# Altium schematic sheet supplies.SchDoc
size A
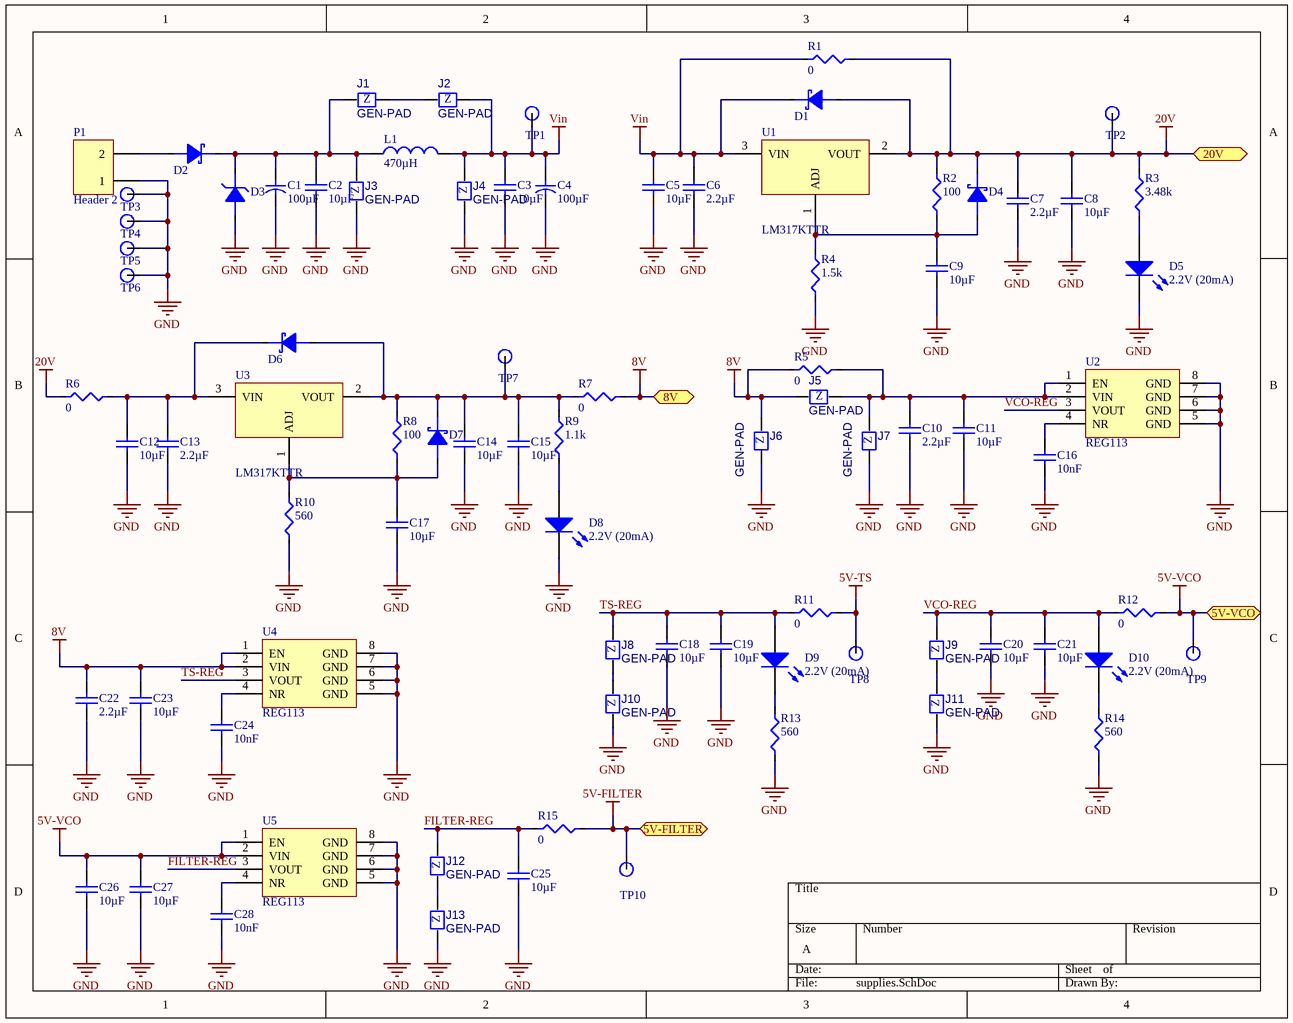
[diagram p0: supplies.SchDoc]

## Parts
C1  100µF  [Radial-SMD-8x10mm]
C2  10µF  [C0805-1.25MM]
C3  10µF  [C0805-1.25MM]
C4  100µF  [Radial-SMD-8x10mm]
C5  10µF  [C0805-1.25MM]
C6  2.2µF  [0402-0.55mm]
C7  2.2µF  [0402-0.55mm]
C8  10µF  [C0805-1.25MM]
C9  10µF  [C0805-1.25MM]
C10  2.2µF  [0402-0.55mm]
C11  10µF  [C0805-1.25MM]
C12  10µF  [C0805-1.25MM]
C13  2.2µF  [0402-0.55mm]
C14  10µF  [0402-0.55mm]
C15  10µF  [0402-0.55mm]
C16  10nF  [C0805-1.25MM]
C17  10µF  [C0805-1.25MM]
C18  10µF  [0402-0.55mm]
C19  10µF  [0402-0.55mm]
C20  10µF  [0402-0.55mm]
C21  10µF  [0402-0.55mm]
C22  2.2µF  [0402-0.55mm]
C23  10µF  [C0805-1.25MM]
C24  10nF  [C0805-1.25MM]
C25  10µF  [0402-0.55mm]
C26  10µF  [0402-0.55mm]
C27  10µF  [0402-0.55mm]
C28  10nF  [C0805-1.25MM]
D1  SCHOTTKY  [SOD-123f]  (value not drawn)
D2  SCHOTTKY  [SOD-123f]  (value not drawn)
D3  ZENER  [DO-214AA]  (value not drawn)
D4  SCHOTTKY  [SOD-123f]  (value not drawn)
D5  2.2V (20mA)  [0805-LED]
D6  SCHOTTKY  [SOD-123f]  (value not drawn)
D7  SCHOTTKY  [SOD-123f]  (value not drawn)
D8  2.2V (20mA)  [0805-LED]
D9  2.2V (20mA)  [0805-LED]
D10  2.2V (20mA)  [0805-LED]
J1  GEN-PAD  [0805-DNP]
J2  GEN-PAD  [0805-DNP]
J3  GEN-PAD  [0805-DNP]
J4  GEN-PAD  [0805-DNP]
J5  GEN-PAD  [0805-DNP]
J6  GEN-PAD  [0805-DNP]
J7  GEN-PAD  [0805-DNP]
J8  GEN-PAD  [0805-DNP]
J9  GEN-PAD  [0805-DNP]
J10  GEN-PAD  [0805-DNP]
J11  GEN-PAD  [0805-DNP]
J12  GEN-PAD  [0805-DNP]
J13  GEN-PAD  [0805-DNP]
L1  value 470µH  [7447709471]  (hidden comment: L)
P1  Header 2  [HDR1X2]
R1  0  [0805-0.45MM]
R2  100  [0805-0.45MM]
R3  3.48k  [0805-0.45MM]
R4  1.5k  [0805-0.45MM]
R5  0  [0805-0.45MM]
R6  0  [0805-0.45MM]
R7  0  [0805-0.45MM]
R8  100  [0805-0.45MM]
R9  1.1k  [0805-0.45MM]
R10  560  [0805-0.45MM]
R11  0  [0805-0.45MM]
R12  0  [0805-0.45MM]
R13  560  [0805-0.45MM]
R14  560  [0805-0.45MM]
R15  0  [0805-0.45MM]
TP1  TP-LOOP  [TP-LOOP]  (value not drawn)
TP2  TP-LOOP  [TP-LOOP]  (value not drawn)
TP3  TP-LOOP  [TP-LOOP]  (value not drawn)
TP4  TP-LOOP  [TP-LOOP]  (value not drawn)
TP5  TP-LOOP  [TP-LOOP]  (value not drawn)
TP6  TP-LOOP  [TP-LOOP]  (value not drawn)
TP7  TP-LOOP  [TP-LOOP]  (value not drawn)
TP8  TP-LOOP  [TP-LOOP]  (value not drawn)
TP9  TP-LOOP  [TP-LOOP]  (value not drawn)
TP10  TP-LOOP  [TP-LOOP]  (value not drawn)
U1  LM317KTTR  [TO-263-4]
U2  REG113  [MSOP8]
U3  LM317KTTR  [TO-263-4]
U4  REG113  [MSOP8]
U5  REG113  [MSOP8]

## Ports
5V-FILTER, 5V-VCO, 8V, 20V

## Nets
5V-FILTER: R15.2 TP10.0 ; port 5V-FILTER
5V-TS: R11.2 TP8.0
5V-VCO: C26.1 C27.1 R12.1 TP9.0 U5.1(EN) U5.2(VIN) ; port 5V-VCO
8V: C22.2 C23.2 J5.2 J6.1 R5.1 R7.2 U4.1(EN) U4.2(VIN) ; port 8V
20V: C7.2 C8.2 D1.A D4.C R1.2 R2.2 R3.2 R6.1 TP2.0 U1.2(VOUT) ; port 20V
GND: C1.1 C2.1 C3.1 C4.1 C5.1 C6.1 C7.1 C8.1 C9.1 C10.1 C11.1 C12.1 C13.1 C14.1 C15.1 C16.1 C17.1 C18.1 C19.1 C20.1 C21.1 C22.1 C23.1 C24.1 C25.2 C26.2 C27.2 C28.1 D3.1(A) D5.C D8.C J3.2 J4.2 J6.2 J7.2 J10.2 J11.2 J13.2 P1.1 R4.1 R10.1 R13.1 R14.1 TP3.0 TP4.0 TP5.0 TP6.0 U2.5(GND) U2.6(GND) U2.7(GND) U2.8(GND) U4.5(GND) U4.6(GND) U4.7(GND) U4.8(GND) U5.5(GND) U5.6(GND) U5.7(GND) U5.8(GND)
Vin: C3.2 C4.2 C5.2 C6.2 D1.C J2.1 J4.1 L1.2 R1.1 TP1.0 U1.3(VIN)
FILTER-REG: C25.1 J12.1 R15.1 U5.3(VOUT)
TS-REG: C18.2 C19.2 D9.A J8.1 R11.1 U4.3(VOUT)
VCO-REG: C20.2 C21.2 D10.A J9.1 R12.2 U2.3(VOUT)
NetC1_2: C1.2 C2.2 D2.C D3.2(C) J1.2 J3.1 L1.1
NetC9_2: C9.2 D4.A R2.1 R4.2 U1.1(ADJ)
NetC10_2: C10.2 C11.2 J5.1 J7.1 R5.2 U2.1(EN) U2.2(VIN)
NetC12_2: C12.2 C13.2 D6.C R6.2 U3.3(VIN)
NetC14_2: C14.2 C15.2 D6.A D7.C R7.1 R8.2 R9.2 TP7.0 U3.2(VOUT)
NetC16_2: C16.2 U2.4(NR)
NetC17_2: C17.2 D7.A R8.1 R10.2 U3.1(ADJ)
NetC24_2: C24.2 U4.4(NR)
NetC28_2: C28.2 U5.4(NR)
NetD2_A: D2.A P1.2
NetD5_A: D5.A R3.1
NetD8_A: D8.A R9.1
NetD9_C: D9.C R13.2
NetD10_C: D10.C R14.2
NetJ1_1: J1.1 J2.2
NetJ8_2: J8.2 J10.1
NetJ9_2: J9.2 J11.1
NetJ12_2: J12.2 J13.1

## Notes on the sheet
- (in symbol EE-GEN-00001) Z

## Library data of the parts
C1 C4 = Radial-SMD-8x10mm: CAP-POL; EE Part Number: EE-CAP-00001; Part Description: CAP ALUM 100UF 50V 20% SMD; Manufacturer: Nichicon; Manufacturer Part Number: UWT1H101MNL1GS; Record Number: 1; Voltage: 50V; Value: 100µF; Datasheet Link: UWT1H101MNL1GS; Supplier 1: DigiKey; Supplier Part Number 1: 493-2226-1-ND; Supplier Link 1: DigiKey; Supplier 2: Mouser; Supplier Part Number 2: 647-UWT1H101MNL1S; Supplier Link 2: Mouser
C2 C3 C5 C8 C9 C12 C17 = C0805-1.25MM: Capacitor; EE Part Number: EE-CAP-00002; Part Description: CAP CER 10UF 35V 10% JB 0805; Manufacturer: TDK; Manufacturer Part Number: C2012JB1V106K085AC; Record Number: 2; Voltage: 35V; PackageDescription: Chip Capacitor; Value: 10µF; Datasheet Link: C2012JB1V106K085AC; Supplier 1: DigiKey; Supplier Part Number 1: 445-11516-1-ND; Supplier Link 1: DigiKey
C6 C7 C13 = 0402-0.55mm: Capacitor; EE Part Number: EE-CAP-00003; Part Description: CAP CER 2.2UF 35V 10% X5R 0402; Manufacturer: TDK; Manufacturer Part Number: C1005X5R1V225K050BC; Record Number: 3; Voltage: 35V; PackageDescription: Chip Capacitor; Value: 2.2µF; Datasheet Link: C1005X5R1V225K050BC; Supplier 1: DigiKey; Supplier Part Number 1: 445-9028-1-ND; Supplier Link 1: DigiKey; Supplier 2: Mouser; Supplier Part Number 2: 810-C1005X5R1V225K; Supplier Link 2: Mouser
C10 C22 = EE-CAP-00003: Capacitor; Part Description: CAP CER 2.2UF 35V 10% X5R 0402; Manufacturer: TDK; Manufacturer Part Number: C1005X5R1V225K050BC; Record Number: 3; Voltage: 35V; PackageDescription: Chip Capacitor; EE Part Number: EE-CAP-00003; Value: 2.2µF; Datasheet Link: C1005X5R1V225K050BC; Supplier 1: DigiKey; Supplier Part Number 1: 445-9028-1-ND; Supplier Link 1: DigiKey; Supplier 2: Mouser; Supplier Part Number 2: 810-C1005X5R1V225K; Supplier Link 2: Mouser
C11 C23 = EE-CAP-00002: Capacitor; Part Description: CAP CER 10UF 35V 10% JB 0805; Manufacturer: TDK; Manufacturer Part Number: C2012JB1V106K085AC; Record Number: 2; Voltage: 35V; PackageDescription: Chip Capacitor; EE Part Number: EE-CAP-00002; Value: 10µF; Datasheet Link: C2012JB1V106K085AC; Supplier 1: DigiKey; Supplier Part Number 1: 445-11516-1-ND; Supplier Link 1: DigiKey
C14 C15 = EE-CAP-00009: Capacitor; Part Description: CAP CER 10UF 10V 20% X5R 0402; Manufacturer: Samsung; Manufacturer Part Number: CL05A106MP5NUNC; Record Number: 9; Voltage: 10V; PackageDescription: Chip Capacitor; EE Part Number: EE-CAP-00009; Value: 10µF; Datasheet Link: CL05A106MP5NUNC; Supplier 1: DigiKey; Supplier Part Number 1: 1276-1450-1-ND; Supplier Link 1: DigiKey
C16 C24 C28 = EE-CAP-00010: Capacitor; Part Description: CAP CER 10000PF 50V 10% X7R 0805; Manufacturer: Murata; Manufacturer Part Number: GRM216R71H103KA01D; Record Number: 10; Voltage: 50V; PackageDescription: Chip Capacitor; EE Part Number: EE-CAP-00010; Value: 10nF; Datasheet Link: GRM216R71H103KA01D; Supplier 1: DigiKey; Supplier Part Number 1: 490-1664-1-ND; Supplier Link 1: DigiKey; Supplier 2: Mouser; Supplier Part Number 2: 81-GRM40X103K50D; Supplier Link 2: Mouser
C18-C21 C25-C27 = EE-CAP-00004: Capacitor; Part Description: CAP CER 10UF 10V 20% X5R 0402; Manufacturer: Samsung; Manufacturer Part Number: CL05A106MP5NUNC; Record Number: 4; Voltage: 10V; PackageDescription: Chip Capacitor; EE Part Number: EE-CAP-00004; Value: 10µF; Datasheet Link: CL05A106MP5NUNC; Supplier 1: DigiKey; Supplier Part Number 1: 1276-1450-1-ND; Supplier Link 1: DigiKey
D1 D2 D4 D6 D7 = 1A: Schottky Diode; EE Part Number: EE-DIODE-00002; Part Description: DIODE SCHOTTKY 30V 1A SFLAT; Manufacturer: Toshiba; Manufacturer Part Number: CRS01(TE85L,Q,M); Record Number: 2; Value: 30V (1A); Voltage: 30V; Current: 1A; Datasheet Link: CRS01(TE85L,Q,M); Supplier 1: DigiKey; Supplier Part Number 1: CRS01QCT-ND; Supplier Link 1: DigiKey; Supplier 2: Mouser; Supplier Part Number 2: 757-CRS01(TE85L,Q,M); Supplier Link 2: Mouser
D3 = EE-DIODE-00004: Part Description: DIODE ZENER 25V 5W DO214AA; Manufacturer: Micro; Manufacturer Part Number: SMBJ5360B-TP; Record Number: 4; Value: 25V (190mA); Voltage: 25V; Current: 190mA; EE Part Number: EE-DIODE-00004; Datasheet Link: SMBJ5360B-TP; Supplier 1: DigiKey; Supplier Part Number 1: SMBJ5360B-TPMSCT-ND; Supplier Link 1: DigiKey
D5 D8-D10 = EE-DIODE-00003: LED; Part Description: LED CHIPLED 570NM GREEN 0805 SMD; Manufacturer: OSRAM; Manufacturer Part Number: LG R971-KN-1; Record Number: 3; Revision: July-2002: Re-released for DXP Platform.; EE Part Number: EE-DIODE-00003; Value: 2.2V (20mA); Voltage: 2.2V; Current: 20mA; Datasheet Link: LG R971-KN-1; Supplier 1: DigiKey; Supplier Part Number 1: 475-1410-1-ND; Supplier Link 1: DigiKey; Supplier 2: Mouser; Supplier Part Number 2: 720-LGR971-KN-1; Supplier Link 2: Mouser
J1-J13 = EE-GEN-00001: Generic Component; Part Description: 0805 Generic Comp; Record Number: 1; EE Part Number: EE-GEN-00001; Value: GEN-0805; Pins: 2; Manufacturer: N/A; Manufacturer Part Number: N/A; Supplier 1: N/A; Supplier Part Number 1: N/A
L1 = 1.4A: Inductor; EE Part Number: EE-L-00002; Part Description: INDUCTOR POWER 470UH 1.4A SMD; Manufacturer: Wurth; Record Number: 2; Current: 1.4A; Tolerance: ±20%; Resistance: 560 mOhm Max; Manufacturer Part Number: 7447709471; Datasheet Link: 7447709471; Supplier 1: DigiKey; Supplier Part Number 1: 732-1699-1-ND; Supplier Link 1: DigiKey; Supplier 2: Mouser; Supplier Part Number 2: 710-7447709471; Supplier Link 2: Mouser
P1 = EM-CON-00012: Part Description: 2-Pin 0.1" Vertical Header; Manufacturer: 3M; Record Number: 12; Value: 961102-6404-AR; EM Part Number: EM-CON-00012; Pins: 2; Manufacturer Part Number: 961102-6404-AR; Supplier 1: Digi-Key; Supplier Part Number 1: 3M9447-ND
R1 R5-R7 R11 R12 R15 = EM-RES-01617: Part Description: RES 0.0 OHM .33W 0805 SMD; Manufacturer: Vishay; Manufacturer Part Number: CRCW08050000Z0EAHP; Record Number: 1617; Power: 0.33W; EM Part Number: EM-RES-01617; Value: 0; Tolerance: N/A; Datasheet Link: http://www.vishay.com/docs/20043/crcwhpe3.pdf; Supplier 1: Digi-Key; Supplier Part Number 1: 541-0.0TBCT-ND; Supplier Link 1: http://www.Digi-Key.com/product-detail/en/CRCW08050000Z0EAHP/541-0.0TBCT-ND/2222831
R2 R8 = EM-RES-01370: Part Description: RES 100 OHM 1/8W 1% 0805 SMD; Manufacturer: Vishay; Manufacturer Part Number: CRCW0805100RFKEA; Record Number: 1370; Tolerance: 1%; Power: 0.125W; EM Part Number: EM-RES-01370; Value: 100; Supplier 1: Digi-Key; Supplier Part Number 1: 541-100CCT-ND
R3 = EM-RES-01196: Part Description: RES 3.48K OHM 1/8W 1% 0805 SMD; Manufacturer: Vishay; Manufacturer Part Number: CRCW08053K48FKEA; Record Number: 1196; Tolerance: 1%; Power: 0.125W; EM Part Number: EM-RES-01196; Value: 3.48k; Supplier 1: Digi-Key; Supplier Part Number 1: 541-3.48KCCT-ND
R4 = EM-RES-01238: Part Description: RES 1.50K OHM 1/8W 1% 0805 SMD; Manufacturer: Vishay; Manufacturer Part Number: CRCW08051K50FKEA; Record Number: 1238; Tolerance: 1%; Power: 0.125W; EM Part Number: EM-RES-01238; Value: 1.5k; Supplier 1: Digi-Key; Supplier Part Number 1: 541-1.50KCCT-ND
R9 = EM-RES-01252: Part Description: RES 1.10K OHM 1/8W 1% 0805 SMD; Manufacturer: Vishay; Manufacturer Part Number: CRCW08051K10FKEA; Record Number: 1252; Tolerance: 1%; Power: 0.125W; EM Part Number: EM-RES-01252; Value: 1.1k; Supplier 1: Digi-Key; Supplier Part Number 1: 541-1.10KCCT-ND
R10 R13 R14 = EM-RES-01285: Part Description: RES 560 OHM 1/8W 1% 0805 SMD; Manufacturer: Vishay; Manufacturer Part Number: CRCW0805560RFKEA; Record Number: 1285; Tolerance: 1%; Power: 0.125W; EM Part Number: EM-RES-01285; Value: 560; Supplier 1: Digi-Key; Supplier Part Number 1: 541-560CCT-ND
TP1-TP10 = EM-TP-00006: Part Description: 0.040" Test Point; Record Number: 6; EM Part Number: EM-TP-00006; Value: TP-LOOP; Pins: 1; Manufacturer: N/A; Manufacturer Part Number: N/A; Supplier 1: N/A; Supplier Part Number 1: N/A
U1 U3 = EE-VREG-00004: Part Description: IC REG LDO ADJ 1.5A DDPAK; Manufacturer: TI; Record Number: 4; Input Voltage: 4.2 V ~ 40 V; Fixed/Adjustable: Positive Adjustable; Output Voltage: 1.25 V ~ 37 V; EE Part Number: EE-VREG-00004; Value: LM317KTTR; Type: Buck; Manufacturer Part Number: LM317KTTR; Datasheet Link: LM317KTTR; Supplier 1: DigiKey; Supplier Part Number 1: 296-21390-1-ND; Supplier Link 1: DigiKey; Supplier 2: Mouser; Supplier Part Number 2: 595-LM317KTTR; Supplier Link 2: Mouser
U2 U4 = EE-VREG-00002: Part Description: IC REG LDO 5V 0.4A 8VSSOP; Manufacturer: TI; Record Number: 2; Value: REG113EA-5/250; Input Voltage: Up to 10V; Fixed/Adjustable: Positive Fixed; Output Voltage: 5V; EE Part Number: EE-VREG-00002; Type: Buck; Manufacturer Part Number: REG113EA-5/250; Datasheet Link: REG113EA-5/250; Supplier 1: DigiKey; Supplier Part Number 1: 296-29170-1-ND; Supplier Link 1: DigiKey; Supplier 2: Mouser; Supplier Part Number 2: 595-REG113EA-5/250; Supplier Link 2: Mouser
U5 = EE-VREG-00003: Part Description: IC REG LDO 2.5V 0.4A 8VSSOP; Manufacturer: TI; Record Number: 3; Value: REG113EA-2.5/2K5; Input Voltage: Up to 10V; Fixed/Adjustable: Positive Fixed; Output Voltage: 2.5V; EE Part Number: EE-VREG-00003; Type: Buck; Manufacturer Part Number: REG113EA-2.5/2K5; Datasheet Link: REG113EA-2.5/2K5; Supplier 1: DigiKey; Supplier Part Number 1: REG113EA2.52K5CT-ND; Supplier Link 1: DigiKey